# Altium schematic sheet I2C extender 0.SchDoc
size A4; SheetNumber: 4; SheetTotal: 6
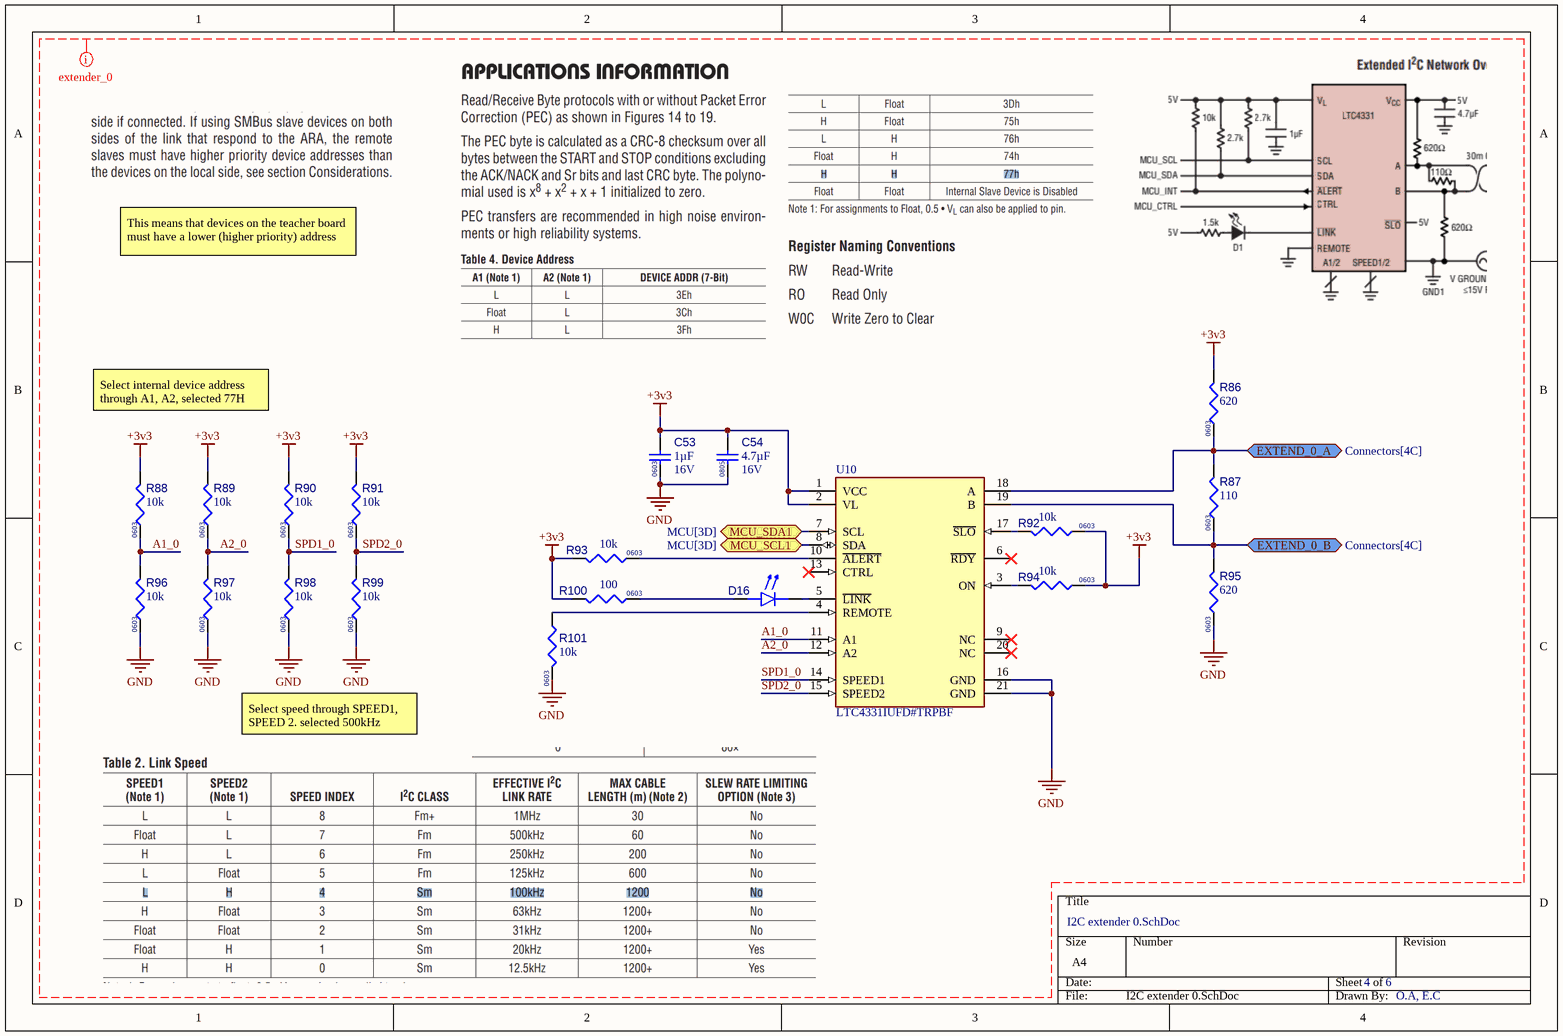
[diagram p0: I2C extender 0.SchDoc]

## Parts
C53  value 1µF  Case/Package: 0603  Voltage Rating: 16V  [CAPC1608X90X35NL15T15]  (hidden comment: Capacitor 1uF +/- 10% 16V 0603)
C54  value 4.7µF  Case/Package: 0805  Rated DC Voltage (URdc): 16V  [CL21A475KOFNNNE-Footprint-1]  (hidden comment: CL21A475KOFNNNE)
D16  150060YS75000  [WL-SMCW_0603_150060xx75000]  (value not drawn)
R86  value 620  Case/Package: 0603  [RC0603JR-0720KL-Footprint-1]  (hidden comment: RC0603FR-07620RL)
R87  value 110  Case/Package: 0603  [RC0603JR-0720KL-Footprint-1]  (hidden comment: RC0603FR-07110RL)
R88  value 10k  Case/Package: 0603  [RESC1608X55X25NL10T15]  (hidden comment: Resistor 10k +/-1% 0603 100 mW)
R89  value 10k  Case/Package: 0603  [RESC1608X55X25NL10T15]  (hidden comment: Resistor 10k +/-1% 0603 100 mW)
R90  value 10k  Case/Package: 0603  [RESC1608X55X25NL10T15]  (hidden comment: Resistor 10k +/-1% 0603 100 mW)
R91  value 10k  Case/Package: 0603  [RESC1608X55X25NL10T15]  (hidden comment: Resistor 10k +/-1% 0603 100 mW)
R92  value 10k  Case/Package: 0603  [RESC1608X55X25NL10T15]  (hidden comment: Resistor 10k +/-1% 0603 100 mW)
R93  value 10k  Case/Package: 0603  [RESC1608X55X25NL10T15]  (hidden comment: Resistor 10k +/-1% 0603 100 mW)
R94  value 10k  Case/Package: 0603  [RESC1608X55X25NL10T15]  (hidden comment: Resistor 10k +/-1% 0603 100 mW)
R95  value 620  Case/Package: 0603  [RC0603JR-0720KL-Footprint-1]  (hidden comment: RC0603FR-07620RL)
R96  value 10k  Case/Package: 0603  [RESC1608X55X25NL10T15]  (hidden comment: Resistor 10k +/-1% 0603 100 mW)
R97  value 10k  Case/Package: 0603  [RESC1608X55X25NL10T15]  (hidden comment: Resistor 10k +/-1% 0603 100 mW)
R98  value 10k  Case/Package: 0603  [RESC1608X55X25NL10T15]  (hidden comment: Resistor 10k +/-1% 0603 100 mW)
R99  value 10k  Case/Package: 0603  [RESC1608X55X25NL10T15]  (hidden comment: Resistor 10k +/-1% 0603 100 mW)
R100  value 100  Case/Package: 0603  [RC0603JR-0720KL-Footprint-1]  (hidden comment: RC0603FR-07100RL)
R101  value 10k  Case/Package: 0603  [RESC1608X55X25NL10T15]  (hidden comment: Resistor 10k +/-1% 0603 100 mW)
U10  LTC4331IUFD#TRPBF  [FP-UFD-20-05-08-1711-IPC_C]

## Ports
EXTEND_0_A (bidir, see Connectors[4C]), EXTEND_0_B (bidir, see Connectors[4C]), MCU_SCL1 (bidir, see MCU[3D]), MCU_SDA1 (bidir, see MCU[3D])

## Nets
+3v3: C53.2 C54.2 R86.2 R88.2 R89.2 R90.2 R91.2 R92.1 R93.1 R94.1 R100.2 U10.1(VCC) U10.2(VL)
GND: C53.1 C54.1 R95.1 R96.1 R97.1 R98.1 R99.1 R101.1 U10.16(GND) U10.21(GND)
A1_0: R88.1 R96.2 U10.11(A1)
A2_0: R89.1 R97.2 U10.12(A2)
EXTEND_0_A: R86.1 R87.2 U10.18(A) ; port EXTEND_0_A
EXTEND_0_B: R87.1 R95.2 U10.19(B) ; port EXTEND_0_B
MCU_SCL1: U10.8(SDA) ; port MCU_SCL1
MCU_SDA1: U10.7(SCL) ; port MCU_SDA1
SPD1_0: R90.1 R98.2 U10.14(SPEED1)
SPD2_0: R91.1 R99.2 U10.15(SPEED2)
NetD16_1: D16.1(K) U10.5(~{LINK})
NetD16_2: D16.2(A) R100.1
NetR92_2: R92.2 U10.17(~{SLO})
NetR93_2: R93.2 U10.10(~{ALERT})
NetR94_2: R94.2 U10.3(ON)
NetR101_2: R101.2 U10.4(REMOTE)

Not connected (* = marked no-connect by the designer): U10 6(~{RDY})* 9(NC)* 13(CTRL)* 20(NC)*

## Layout directives
mark named extender_0: +3v3, A1_0, A2_0, GND, SPD1_0, SPD2_0

## Notes on the sheet
- This means that devices on the teacher board must have a lower (higher priority) address
- Select internal device address through A1, A2, selected 77H
- Select speed through SPEED1, SPEED 2. selected 500kHz
- O.A, E.C

## Library data of the parts
C53 = CMP-001-00004-8: Chip Capacitor, 1 uF, +/- 10%, 16 V, 0603 (1608 Metric); Capacitor Type: Ceramic; Mounting Technology: SM; RoHS Compliant: True; Min Operating Temperature: -55°C; Pins: 2; Max Operating Temperature: 125°C; Tolerance: 10%
C54 = CMP-001-00089-2: Ceramic Capacitor, Multilayer, Ceramic, 16V, 10% +Tol, 10% -Tol, X5R, 15% TC, 4.7uF, Surface Mount, 0805; Multilayer: Yes; Dielectric Material: Ceramic; Tolerance (fill in as +-): 10%; Pins: 2; Package Style: SMTMeter; Max Operating Temperature: 85°C; JESD-609 Code: e3; Termination: Wraparound; Min Operating Temperature: -55°C; RoHS Compliant: Yes; Mounting Technology: Surface Mount; Reach SVHC Compliant: Yes; Terminal Finish: Nickel; Packaging: Tape and Reel; Capacitor Type: Ceramic; Height: 1.35mm; Width: 1.25mm; Temperature Characteristics Code: X5R; Length: 2mm; Tolerance  (fill in as +-): 10%; Package Shape: Rectangular
D16 = CMP-007-00046-1: Single Color LED, Yellow, Water Clear, 1.1mm; Shape: Rectangular; Forward Current: 30mA; Forward Voltage: 2V; Viewing Angle: 140°; Channels: 1; Luminous Intensity-Nom: 120mcd; Overall Height: 0.7mm; Packaging: Tape and Reel; Size: 1.1mm; Max Operating Temperature: 85°C; RoHS Compliant: Yes; Color: Yellow; Pins: 2; Lens Style: WATER CLEAR; Reach SVHC Compliant: Yes; Terminal Pitch: 1.6mm; Mounting Technology: Surface Mount; Min Operating Temperature: -40°C; Optoelectronic Device Type: SINGLE COLOR LED
R86 R95 = CMP-009-00191-1: Fixed Resistor, Metal Glaze/thick Film, 0.1W, 620ohm, 75V, 1% +/-Tol, 100ppm/Cel, Surface Mount, 0603; Power: 100mW; Additional Feature: LASER TRIMMABLE; Package Height: 0.45mm; Package Width: 0.8mm; Temperature Coefficient: 100ppm/°C; Rated Temperature: 70°C; Package Length: 1.6mm; Package Shape: Rectangular; Min Operating Temperature: -55°C; Technology: METAL GLAZE/THICK FILM; Reach SVHC Compliant: Yes; Pins: 2; Working Voltage: 75V; Tolerance: 1%; Terminal Finish: Nickel; RoHS Compliant: Yes; Termination: Wraparound; Construction: Chip; JESD-609 Code: e3; Mounting Technology: Surface Mount; Max Operating Temperature: 155°C; Package Style: SMTMeter; Packaging: Tape and Reel; Resistor Type: FIXED RESISTOR
R87 = CMP-009-00190-1: Fixed Resistor, Metal Glaze/thick Film, 0.1W, 110ohm, 75V, 1% +/-Tol, 100ppm/Cel, Surface Mount, 0603; Package Length: 1.6mm; Temperature Coefficient: 100ppm/°C; Power: 100mW; Package Height: 0.45mm; Package Width: 0.8mm; Additional Feature: LASER TRIMMABLE; Rated Temperature: 70°C; Termination: Wraparound; JESD-609 Code: e3; RoHS Compliant: Yes; Tolerance: 1%; Max Operating Temperature: 155°C; Package Style: SMTMeter; Terminal Finish: Nickel; Packaging: Tape and Reel; Package Shape: Rectangular; Pins: 2; Working Voltage: 75V; Construction: Chip; Resistor Type: FIXED RESISTOR; Technology: METAL GLAZE/THICK FILM; Reach SVHC Compliant: Yes; Mounting Technology: Surface Mount; Min Operating Temperature: -55°C
R88-R94 R96-R99 R101 = CMP-009-00017-7: Chip Resistor, 10 KOhm, +/- 1%, 01 W, -55 to 155 degC, 0603 (1608 Metric); Voltage Rating: 50V; Power: 100mW; RoHS Compliant: True; Min Operating Temperature: -55°C; Pins: 2; Mounting Technology: SM; Max Operating Temperature: 155°C; Tolerance: 1%
R100 = CMP-009-00189-1: Fixed Resistor, Metal Glaze/thick Film, 0.1W, 100ohm, 75V, 1% +/-Tol, 100ppm/Cel, Surface Mount, 0603; Rated Temperature: 70°C; Package Width: 0.8mm; Package Length: 1.6mm; Package Height: 0.45mm; Additional Feature: LASER TRIMMABLE; Temperature Coefficient: 100ppm/°C; Power: 100mW; Package Shape: Rectangular; Tolerance: 1%; JESD-609 Code: e3; Resistor Type: FIXED RESISTOR; Terminal Finish: Nickel; Max Operating Temperature: 155°C; Reach SVHC Compliant: Yes; Technology: METAL GLAZE/THICK FILM; Mounting Technology: Surface Mount; RoHS Compliant: Yes; Construction: Chip; Packaging: Tape and Reel; Package Style: SMTMeter; Termination: Wraparound; Working Voltage: 75V; Min Operating Temperature: -55°C; Pins: 2
U10 = CMP-015-00011-1: Interface Circuit, CMOS, PQCC20; Throw Configuration: POWER SUPPLY SUPPORT CIRCUIT; Reach SVHC Compliant: Yes; RoHS Compliant: Yes